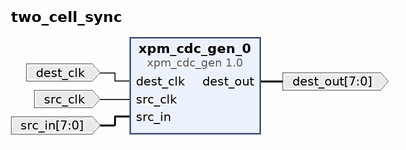
[diagram p0: block diagram of the top level]
# Vivado block design two_cell_sync, xc7z020clg484-1, Vivado 2022.1
create_bd_design two_cell_sync

create_bd_port -dir I -type clk src_clk
set_property -dict {CONFIG.FREQ_HZ 200000000} [get_bd_ports src_clk]
create_bd_port -dir I -type clk dest_clk
set_property -dict {CONFIG.FREQ_HZ 100000000} [get_bd_ports dest_clk]
create_bd_port -dir I -from 7 -to 0 src_in
create_bd_port -dir O -from 7 -to 0 dest_out

create_bd_cell -type ip -vlnv xilinx.com:ip:xpm_cdc_gen:1.0 xpm_cdc_gen_0
set_property -dict {CONFIG.CDC_TYPE xpm_cdc_array_single CONFIG.DEST_SYNC_FF 2 CONFIG.WIDTH 8} [get_bd_cells xpm_cdc_gen_0]

# ---- connections ----

connect_bd_net [get_bd_ports dest_clk] [get_bd_pins xpm_cdc_gen_0/dest_clk]
connect_bd_net [get_bd_ports src_clk] [get_bd_pins xpm_cdc_gen_0/src_clk]
connect_bd_net [get_bd_ports src_in] [get_bd_pins xpm_cdc_gen_0/src_in]
connect_bd_net [get_bd_pins xpm_cdc_gen_0/dest_out] [get_bd_ports dest_out]

validate_bd_design
save_bd_design
